# EasyEDA Pro project ProPrj_（课设）太阳能板最大功率点追踪主控板 Solar MPPT Tracking controlling board_2024-09-24.epro, board PCB1
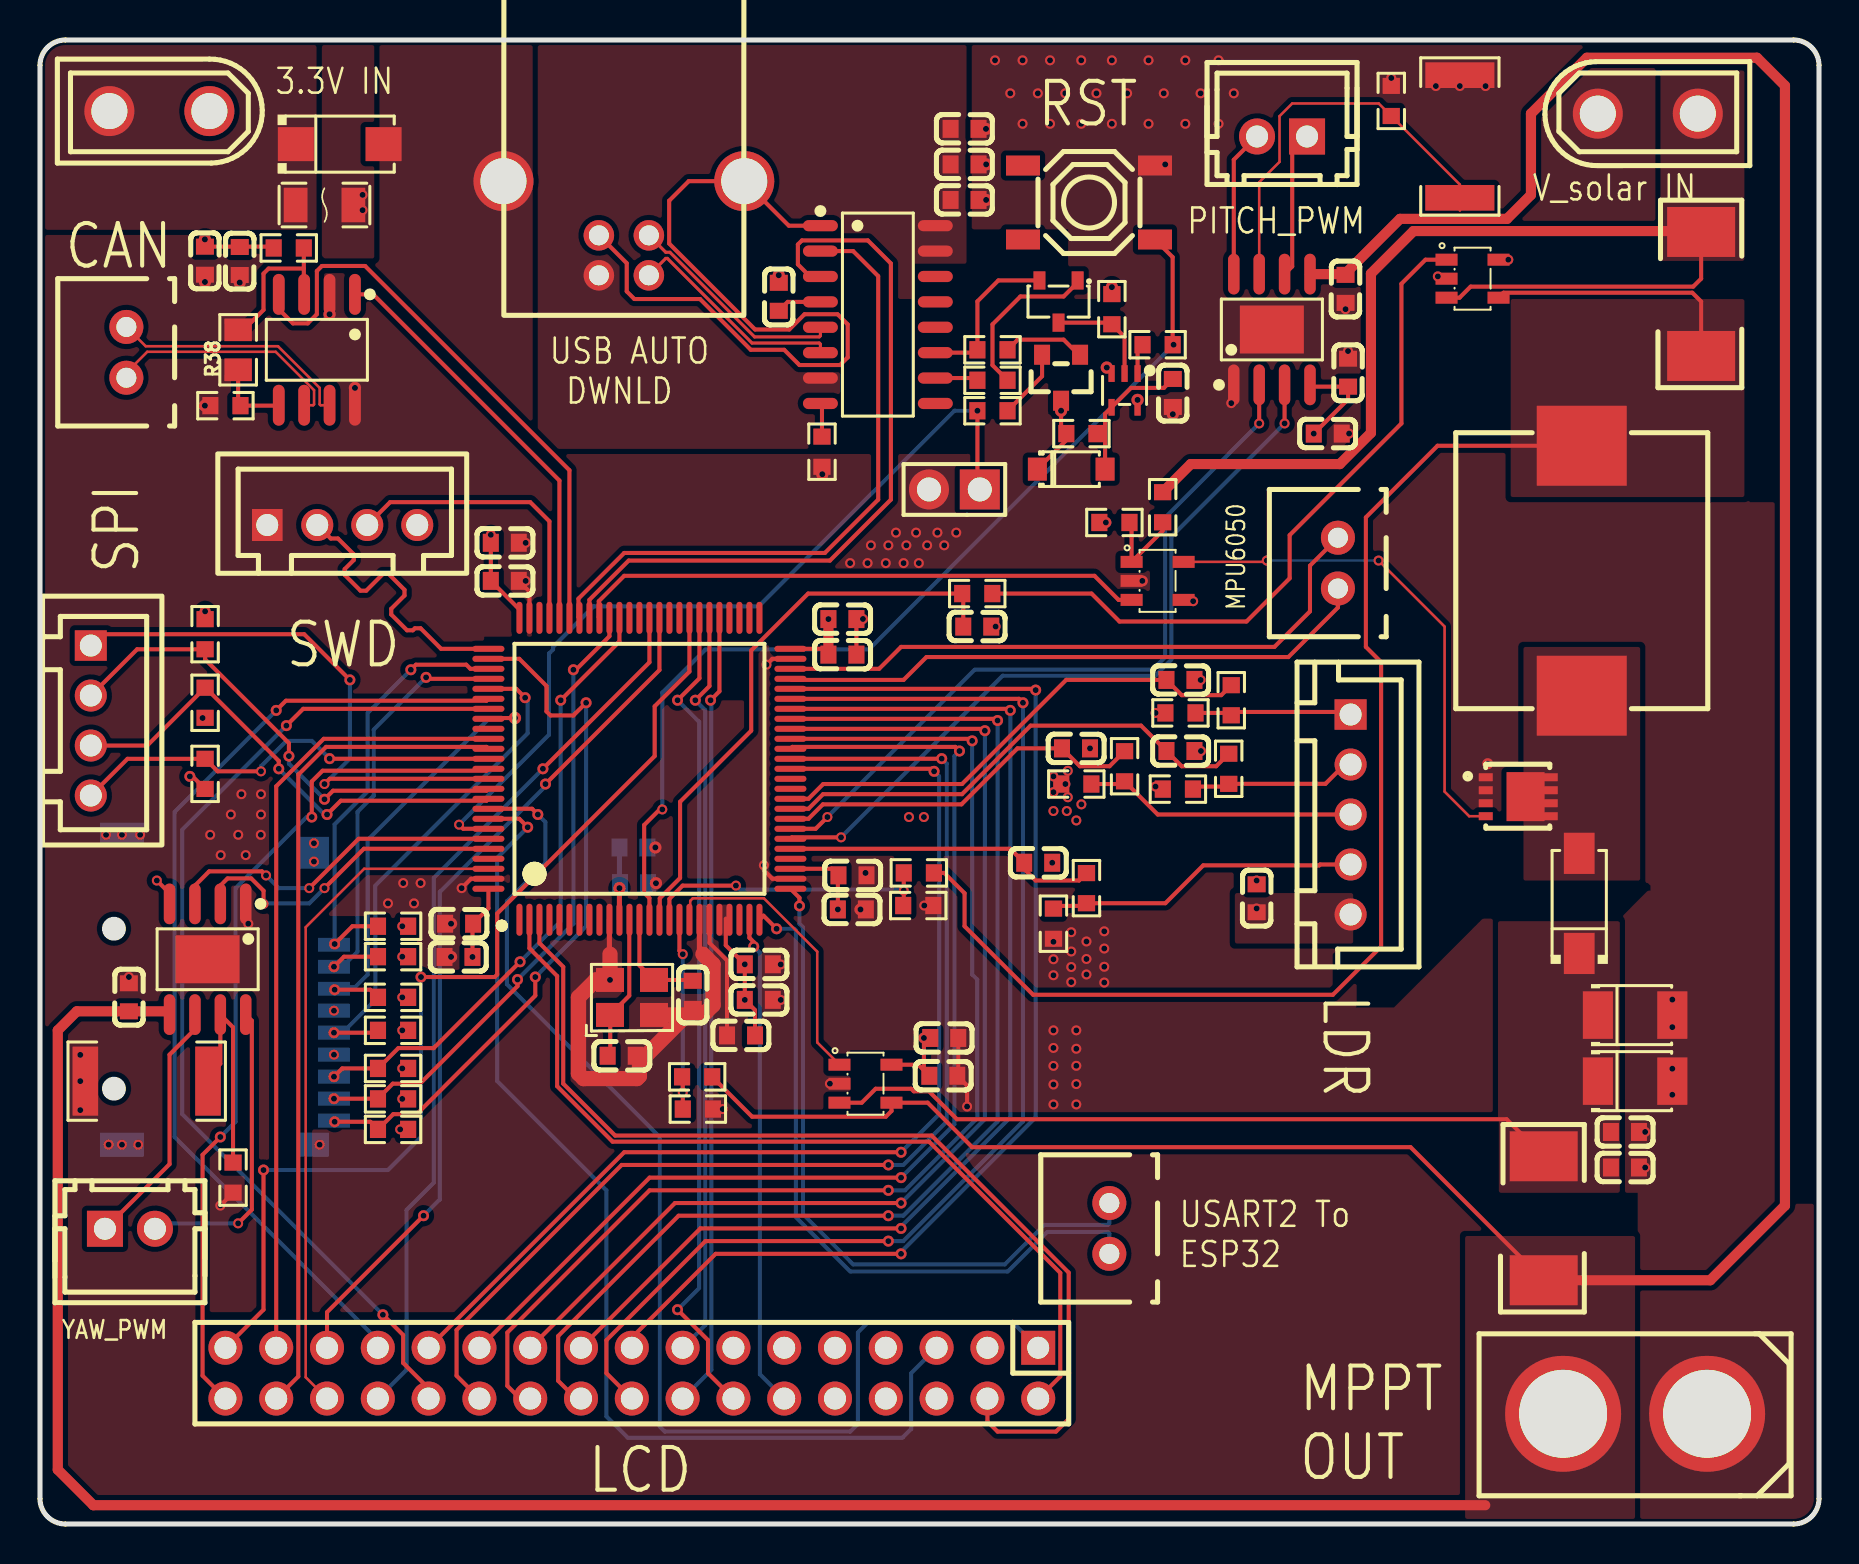
[diagram p4: board, top side]
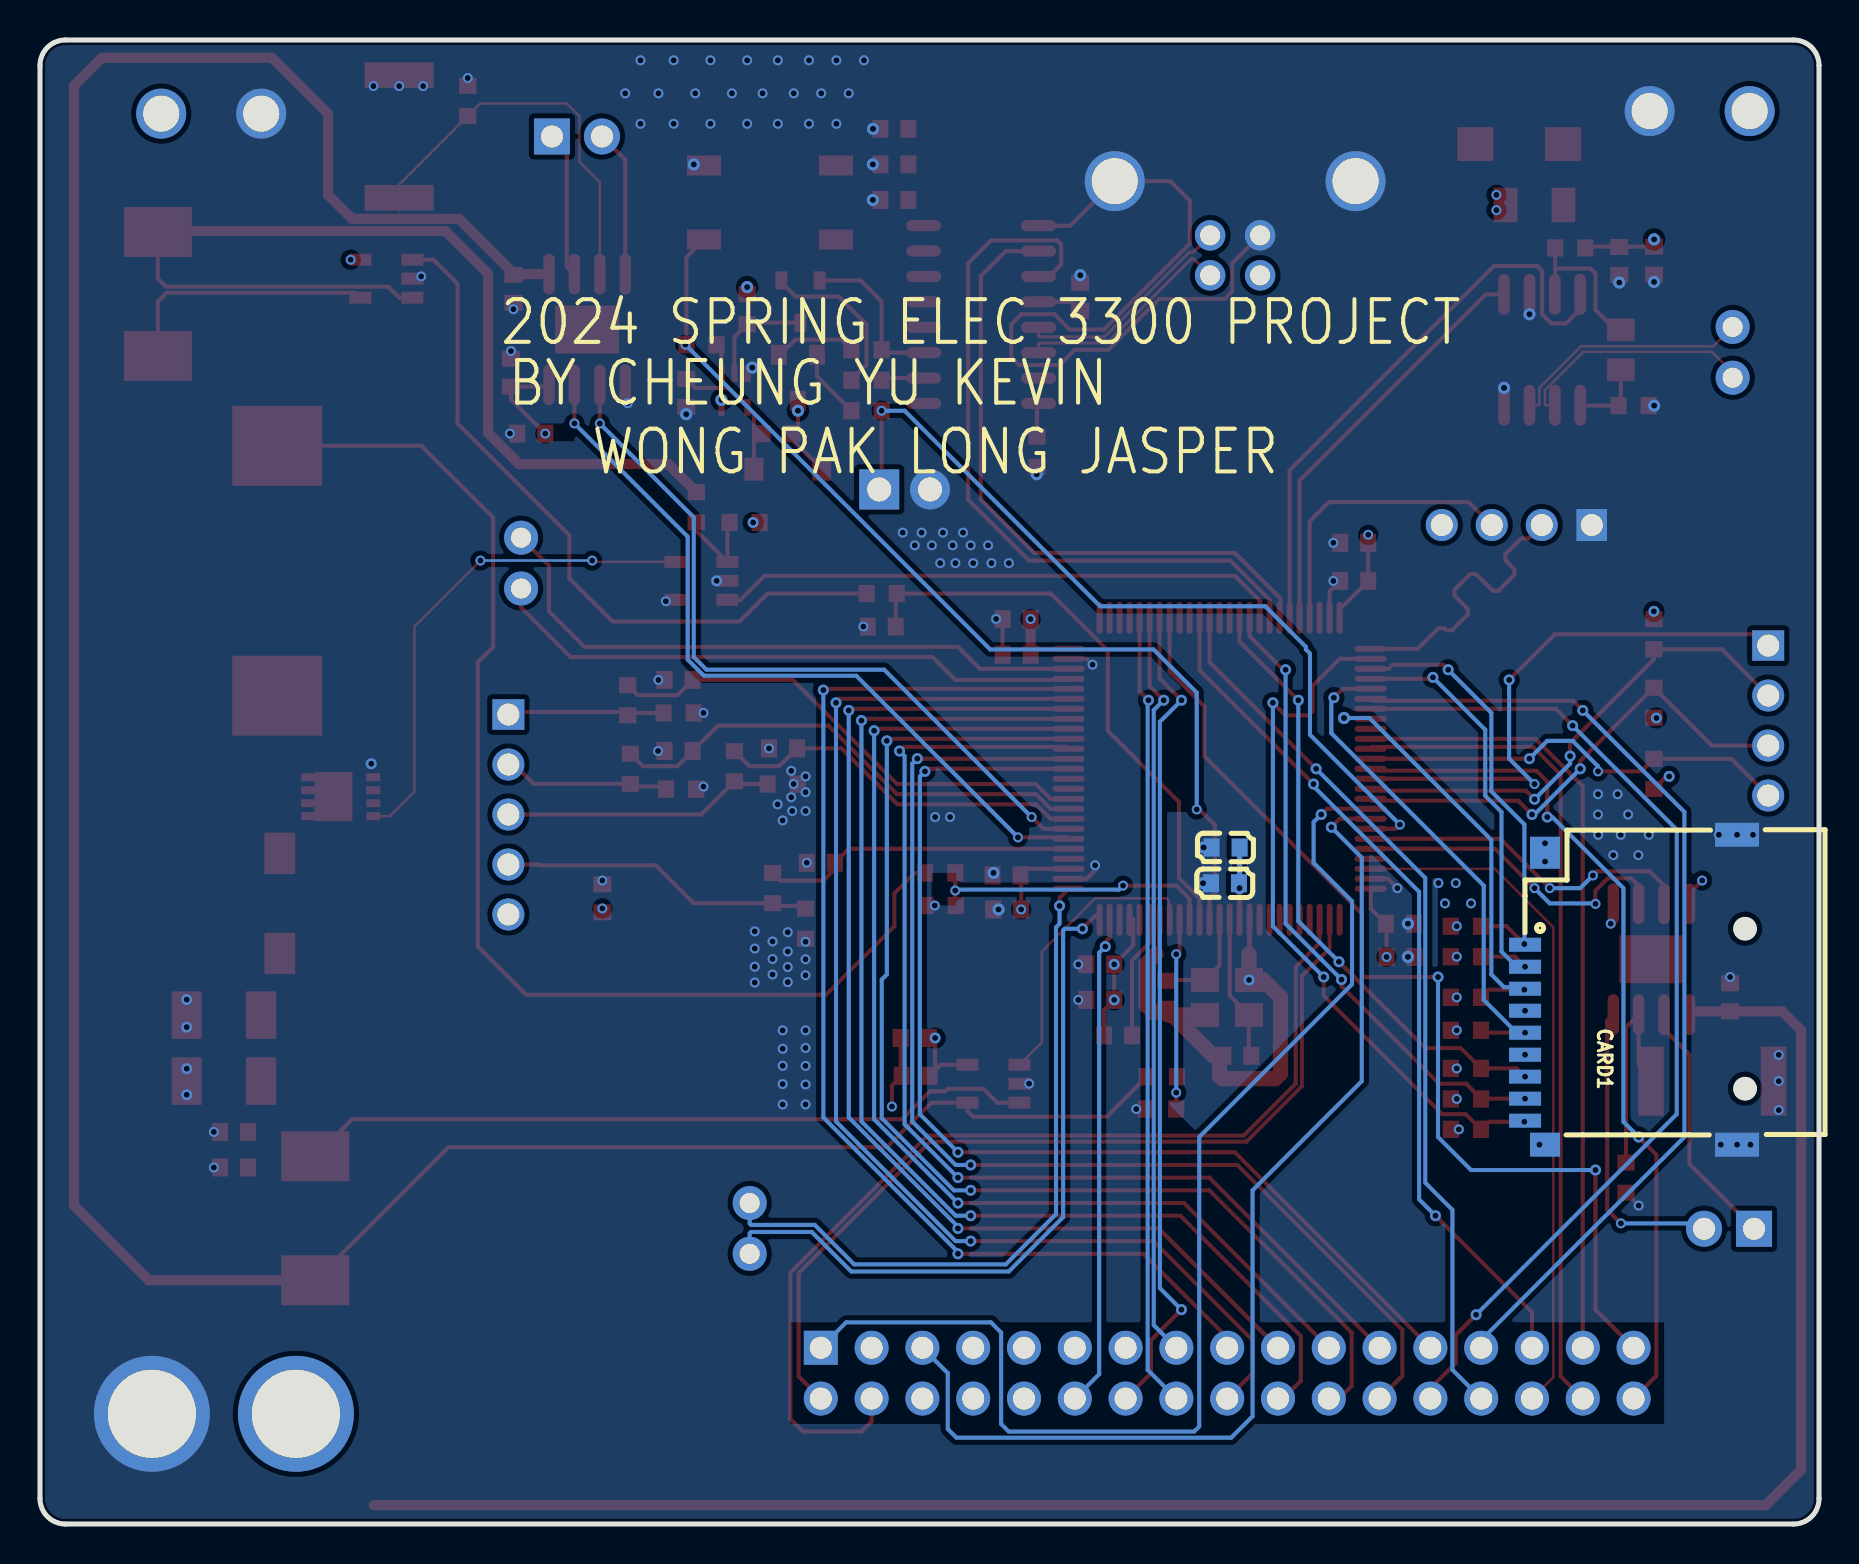
[diagram p5: board, bottom side, seen from below]

Outline 88.95 x 74.22 mm; copper layers: Top Layer, Inner1, Inner2, Bottom Layer. Coordinates in mm from the lower left corner of the outline.
Outline path: 0,72.95 0,1.27 arc(0.37,0.37) 1.27,0 87.68,0 arc(88.58,0.37) 88.95,1.27 88.95,72.95 arc(88.58,73.85) 87.68,74.22 1.27,74.22 arc(0.37,73.85) 0,72.95
Stack: Top Layer 0.035mm 外层铜厚1oz / Dielectric1 0.0994mm 3313 RC57% 4.2mil / Inner1 0.0152mm 内层铜厚 / Dielectric2 1.265mm 1.3mm H/HOZ 含铜 / Inner2 0.0152mm 内层铜厚 / Dielectric3 0.0994mm 3313 RC57% 4.2mil / Bottom Layer 0.035mm 外层铜厚1oz

## Design rules (mm)
net CAN_TX: DP3
net CAN_RX: DP3
net USART2_RX: DP5
net USART2_TX: DP5
net VET6-OSC_OUT: DP1
net VET6-OSC_IN: DP1
net CH343-D+: DP2
net CH343-D-: DP2
net $2N39854: DP4
net $2N39851: DP4
template: 自定义配置
spacing copperThickness1oz (default): track to track 0.102, other pairs 0.152 to 0.3
spacing copperThickness2oz: track to track 0.203, other pairs 0.152 to 0.3
track width copperThickness1oz (default): min 0.127, default 0.254, max 2.54
track width copperThickness2oz: min 0.203, default 0.254, max 2.54
differential pair differentialPair (default): width min 0.127, default 0.254, max 2.54; gap min 0.152, default 0.152
via viaSize (default): diameter min 0.5, default 0.61, max 10; hole min 0.3, default 0.305, max 6.3

## Placement (name value [footprint] x y rotation side)
C1  100nF  [C0603]  23.24 49.07 180 top
C2  100nF  [C0603]  23.24 47.17 180 top
C3  100nF  [C0603]  29.67 33.83 180 bottom
C4  100nF  [C0603]  29.7 32.04 180 bottom
C5  100nF  [C0603]  35.94 26.21 180 top
C6  100nF  [C0603]  35.94 27.99 180 top
C7  100nF  [C0603]  20.95 30.02 0 top
C8  100nF  [C0603]  20.92 28.36 0 top
C9  100nF  [C0603]  40.59 30.74 180 top
C10  100nF  [C0603]  40.62 32.44 180 top
C11  10nF  [C0603]  35.05 24.44 0 top
C12  100nF  [C0603]  40.12 43.48 180 top
C13  100nF  [C0603]  40.12 45.26 180 top
C14  100nF  [C0603]  46.23 69.77 0 top
C15  100nF  [C0603]  36.94 61.38 90 top
C16  10uF  [C0603]  46.23 68 0 top
C17  100nF  [C0603]  46.23 66.22 0 top
C18  100nF  [C0603]  56.64 56.57 90 top
C19  10pF  [C0603]  29.08 23.42 180 top
C20  10pF  [C0603]  32.64 26.47 90 top
C23  100nF  [C0603]  65.4 57.58 90 top
C24  10uF  [C0603]  64.39 54.53 0 top
C27  100nF  [C0603]  65.28 61.77 90 top
C28  100nF  [C0603]  4.44 26.34 270 top
C29  100nF  [C0603]  79.25 19.61 180 top
C30  100nF  [C0603]  79.25 17.83 180 top
C31  100uF  [CASE-B_3528]  79.76 25.45 0 top
C32  100uF  [CASE-B_3528]  79.76 22.15 0 top
C37  100nF  [C0603]  49.91 33.07 180 top
C38  100nF  [C0603]  51.8 38.79 180 top
C39  100nF  [C0603]  57.02 38.66 180 top
C40  100nF  [C0603]  57.02 42.22 180 top
C41  100nF  [C0603]  45.17 22.42 0 top
C42  10uF  [C0603]  45.21 24.31 0 top
C43  100nF  [C0603]  9.99 63.17 90 top
C44  100nF  [C0603]  8.25 63.18 90 top
C45  100nF  [C0603]  60.83 31.29 270 top
C46  100nF  [C0603]  46.86 44.88 0 top
CARD1  TF PUSH  [TF-SMD_TF-PUSH]  9.4 26.72 90 bottom
CN1  XT30UPB-M  [CONN-TH_XT30UPB-M]  80.39 70.54 0 top
CN2  XT30UPB-M  [CONN-TH_XT30UPB-M]  5.97 70.66 180 top
CN3  ZX-XH2.54-2PZZ  [CONN-TH_2P-P2.50_HX25003-2A]  4.5 14.77 0 top
CN4  ZX-XH2.54-2PZZ  [CONN-TH_2P-P2.50_HX25003-2A]  62.1 69.39 180 top
CN5  B2B-XH-A(LF)(SN)  [CONN-TH_B2B-XH-A-LF-SN]  4.32 58.6 90 top
CN6  B2B-XH-A(LF)(SN)  [CONN-TH_B2B-XH-A-LF-SN]  53.47 14.78 90 top
CN7  B2B-XH-A(LF)(SN)  [CONN-TH_B2B-XH-A-LF-SN]  64.9 48.06 90 top
D1  SS54  [SMA_L4.4-W2.8-LS5.4-R-RD]  76.96 31.04 90 top
D2  SMAJ5.0A  [SMA_L4.4-W2.6-LS5.0-RD]  14.99 69.01 0 top
F1  JK-nSMD050-30  [F1206]  14.22 65.96 0 top
H1  PH-00047  [HDR-TH_34P-P2.54-V-M-R2-C17-S2.54]  29.59 7.54 180 top
H2  PZ254V-11-02P  [HDR-TH_2P-P2.54-V-M]  45.72 51.74 180 top
L1  10uH  [IND-SMD_L13.8-W12.6_SMMS1360]  77.09 47.68 270 top
Q2  AO3401  [SOT-23-3_L2.9-W1.4-P1.90-LS2.6-BR]  50.93 61.14 90 top
Q3  AO3400  [SOT-23_L2.9-W1.3-P1.90-LS2.4-BR]  51.05 57.33 90 top
Q5  CSD17579Q3A  [SON-8_L3.0-W3.1-P0.65-BP-EP]  73.91 36.37 270 top
R1  4.7K  [R0603]  39.1 53.63 90 top
R2  10K  [R0603]  53.59 60.76 90 top
R3  2.7K  [R0603]  47.62 57.2 0 top
R4  1K  [R0603]  47.62 58.73 0 top
R5  1K  [R0603]  47.62 55.68 180 top
R6  2.7K  [R0603]  55.88 58.98 180 top
R7  100K  [R0603]  52.07 54.53 0 top
R8  50mΩ  [RES-SMD_L6.4-W3.2-1]  83.06 61.52 270 top
R10  100mΩ  [R2512]  70.99 69.39 90 top
R11  100mΩ  [R2512]  5.33 22.15 180 top
R12  0  [R0603]  9.65 17.32 270 top
R13  0  [R0603]  67.56 71.17 90 top
R14  10K  [R0603]  17.65 19.74 180 top
R15  10K  [R0603]  17.65 21.26 180 top
R16  10K  [R0603]  17.65 22.78 180 top
R17  10K  [R0603]  17.65 24.69 180 top
R18  10K  [R0603]  17.65 26.34 180 top
R19  10K  [R0603]  17.65 28.37 180 top
R20  10K  [R0603]  17.65 29.9 180 top
R21  1.5K  [R0603]  50.67 30.02 90 top
R25  1K  [R0603]  52.32 31.8 90 top
R26  1.5K  [R0603]  51.82 37.01 0 top
R27  1K  [R0603]  54.23 37.9 90 top
R28  1.5K  [R0603]  56.9 36.75 0 top
R29  1K  [R0603]  59.44 37.77 90 top
R30  1.5K  [R0603]  57.02 40.56 0 top
R31  1K  [R0603]  59.56 41.2 90 top
R32  10K  [R0603]  43.94 32.56 0 top
R33  2k  [R0603]  43.91 30.93 180 top
R34  15K  [R0603]  32.86 22.36 0 top
R35  2k  [R0603]  32.89 20.75 180 top
R36  50mΩ  [RES-SMD_L6.4-W3.2-1]  75.18 15.29 270 top
R37  10K  [R0603]  9.27 55.93 0 top
R38  10K  [R0805]  9.91 58.73 90 top
R39  0  [R0603]  12.44 63.82 180 top
R40  10K  [R0603]  8.25 37.52 270 top
R41  10K  [R0603]  8.25 41.07 270 top
R42  10K  [R0603]  8.25 44.5 90 top
R43  0  [R0603]  53.72 50.09 180 top
R44  0  [R0603]  56.13 50.85 90 top
R45  1K  [R0603]  46.86 46.53 180 top
SW1  TS-1187A-B-A-B  [SW-SMD_4P-L5.1-W5.1-P3.70-LS6.5-TL-2]  52.45 66.09 180 top
U1  STM32F103VET6  [LQFP-100_L14.0-W14.0-P0.50-LS16.0-BL]  29.97 37.77 0 top
U2  CH343G  [SOP-16_L10.0-W3.9-P1.27-LS6.0-BL]  41.89 60.49 270 top
U3  74HC1G66GW,125  [SOT-353_L2.1-W1.3-P0.65-LS2.3-BR]  54.23 56.69 90 top
U4  1N4148W  [SOD-123_L2.8-W1.8-LS3.7-RD]  51.56 52.76 0 top
U5  INA180A2IDBVT  [SOT-23-5_L3.0-W1.7-P0.95-LS2.8-BR]  71.63 62.28 180 top
U6  UCC27517DBVR  [SOT-23-5_L3.0-W1.7-P0.95-LS2.8-BR]  55.88 47.17 180 top
U10  DRV8870DDAR  [HSOP-8_L5.0-W4.0-P1.27-LS6.2-BL-EP]  61.59 59.74 0 top
U11  DRV8870DDAR  [HSOP-8_L5.0-W4.0-P1.27-LS6.2-BL-EP]  8.38 28.25 180 top
U14  INA180A2IDBVT  [SOT-23-5_L3.0-W1.7-P0.95-LS2.8-BR]  41.27 22.02 180 top
U15  SWD_Conn  [CONN-TH_4P-P2.50_4PIN]  15.11 49.96 0 top
U16  LDR_Conn  [CONN-TH_5P-P2.50_ZX-XH2.54-5PZZ]  65.53 35.48 270 top
U17  SN65HVD230DR  [SOIC-8_L4.9-W3.9-P1.27-LS6.0-BL]  13.84 58.73 180 top
U18  ZX-XH2.54-4PZZ  [CONN-TH_4P-P2.50_4PIN]  2.54 40.18 270 top
U19  XT60  [CONN-TH_XT60]  79.76 5.51 180 top
USB1  670688000  [USB-B-TH_67068-8000]  29.19 64.8 180 top
X1  8MHz  [OSC-SMD_4P-L3.2-W2.5-BL]  29.6 26.34 0 top

## Footprints (pads in the part's own frame, mm; a bottom-side part is the same pattern mirrored in y, then rotated)
C0603
  rect 0.8x0.9 smd: 1(-0.7,0) 2(0.7,0)
CASE-B_3528
  rect 1.506x2.376 smd: 1(-1.861,0) 2(1.861,0)
CONN-TH_2P-P2.50_HX25003-2A
  rect 1.8x1.8 hole 1.1: 1(-1.25,0)
  round 1.8 hole 1.1: 2(1.25,0)
CONN-TH_4P-P2.50_4PIN
  rect 1.524x1.6 hole 1.1: 1(-3.75,0)
  round 1.6 hole 1.1: 2(-1.25,0) 3(1.25,0) 4(3.75,0)
CONN-TH_5P-P2.50_ZX-XH2.54-5PZZ
  rect 1.524x1.6 hole 1.1: 1(-5,0)
  round 1.6 hole 1.1: 2(-2.5,0) 3(0,0) 4(2.5,0) 5(5,0)
CONN-TH_B2B-XH-A-LF-SN
  round 1.7 hole 1: 1(1.27,0) 2(-1.27,0)
CONN-TH_XT30UPB-M
  round 2.5 hole 1.8: 1(-2.5,0) 2(2.5,0)
CONN-TH_XT60
  round 5.8 hole 4.4: 1(-3.6,0) 2(3.6,0)
F1206
  rect 1.19x1.728 smd: 1(-1.445,0) 2(1.445,0)
HDR-TH_2P-P2.54-V-M
  rect 2x2 hole 1.2: 1(-1.27,0)
  round 2 hole 1.2: 2(1.27,0)
HDR-TH_34P-P2.54-V-M-R2-C17-S2.54
  rect 1.7x1.7 hole 1.1: 1(-20.32,-1.27)
  round 1.7 hole 1.1: 2(-20.32,1.27) 3(-17.78,-1.27) 4(-17.78,1.27) 5(-15.24,-1.27) 6(-15.24,1.27) 7(-12.7,-1.27) 8(-12.7,1.27) 9(-10.16,-1.27) 10(-10.16,1.27) 11(-7.62,-1.27) 12(-7.62,1.27) 13(-5.08,-1.27) 14(-5.08,1.27) 15(-2.54,-1.27) 16(-2.54,1.27) 17(0,-1.27) 18(0,1.27) 19(2.54,-1.27) 20(2.54,1.27) 21(5.08,-1.27) 22(5.08,1.27) 23(7.62,-1.27) 24(7.62,1.27) 25(10.16,-1.27) 26(10.16,1.27) 27(12.7,-1.27) 28(12.7,1.27) 29(15.24,-1.27) 30(15.24,1.27) 31(17.78,-1.27) 32(17.78,1.27) 33(20.32,-1.27) 34(20.32,1.27)
HSOP-8_L5.0-W4.0-P1.27-LS6.2-BL-EP
  oval 0.574x2.038 smd: 1(-1.905,-2.769) 2(-0.635,-2.769) 3(0.635,-2.769) 4(1.905,-2.769) 5(1.905,2.769) 6(0.635,2.769) 7(-0.635,2.769) 8(-1.905,2.769)
  rect 3.2x2.4 smd: 9(0,0)
IND-SMD_L13.8-W12.6_SMMS1360
  rect 4x4.5 smd: 1(-6.25,0) 2(6.25,0)
LQFP-100_L14.0-W14.0-P0.50-LS16.0-BL
  oval 0.3x1.6 smd: 1(-6,-7.55) 2(-5.5,-7.55) 3(-5,-7.55) 4(-4.5,-7.55) 5(-4,-7.55) 6(-3.5,-7.55) 7(-3,-7.55) 8(-2.5,-7.55) 9(-2,-7.55) 10(-1.5,-7.55) 11(-1,-7.55) 12(-0.5,-7.55) 13(0,-7.55) 14(0.5,-7.55) 15(1,-7.55) 16(1.5,-7.55) 17(2,-7.55) 18(2.5,-7.55) 19(3,-7.55) 20(3.5,-7.55) 21(4,-7.55) 22(4.5,-7.55) 23(5,-7.55) 24(5.5,-7.55) 25(6,-7.55) 51(6,7.55) 52(5.5,7.55) 53(5,7.55) 54(4.5,7.55) 55(4,7.55) 56(3.5,7.55) 57(3,7.55) 58(2.5,7.55) 59(2,7.55) 60(1.5,7.55) 61(1,7.55) 62(0.5,7.55) 63(0,7.55) 64(-0.5,7.55) 65(-1,7.55) 66(-1.5,7.55) 67(-2,7.55) 68(-2.5,7.55) 69(-3,7.55) 70(-3.5,7.55) 71(-4,7.55) 72(-4.5,7.55) 73(-5,7.55) 74(-5.5,7.55) 75(-6,7.55)
  oval 1.6x0.3 smd: 26(7.55,-6) 27(7.55,-5.5) 28(7.55,-5) 29(7.55,-4.5) 30(7.55,-4) 31(7.55,-3.5) 32(7.55,-3) 33(7.55,-2.5) 34(7.55,-2) 35(7.55,-1.5) 36(7.55,-1) 37(7.55,-0.5) 38(7.55,0) 39(7.55,0.5) 40(7.55,1) 41(7.55,1.5) 42(7.55,2) 43(7.55,2.5) 44(7.55,3) 45(7.55,3.5) 46(7.55,4) 47(7.55,4.5) 48(7.55,5) 49(7.55,5.5) 50(7.55,6) 76(-7.55,6) 77(-7.55,5.5) 78(-7.55,5) 79(-7.55,4.5) 80(-7.55,4) 81(-7.55,3.5) 82(-7.55,3) 83(-7.55,2.5) 84(-7.55,2) 85(-7.55,1.5) 86(-7.55,1) 87(-7.55,0.5) 88(-7.55,0) 89(-7.55,-0.5) 90(-7.55,-1) 91(-7.55,-1.5) 92(-7.55,-2) 93(-7.55,-2.5) 94(-7.55,-3) 95(-7.55,-3.5) 96(-7.55,-4) 97(-7.55,-4.5) 98(-7.55,-5) 99(-7.55,-5.5) 100(-7.55,-6)
OSC-SMD_4P-L3.2-W2.5-BL
  rect 1.4x1.2 smd: 1(-1.1,-0.875) 2(1.1,-0.875) 3(1.1,0.875) 4(-1.1,0.875)
R0603
  rect 0.806x0.864 smd: 1(-0.753,0) 2(0.753,0)
R0805
  rect 1.133x1.377 smd: 1(-1,0) 2(1,0)
R2512
  rect 1.282x3.456 smd: 1(-3.067,0) 2(3.067,0)
RES-SMD_L6.4-W3.2-1
  rect 2.5x3.4 smd: 1(-3.1,0) 2(3.1,0)
SMA_L4.4-W2.6-LS5.0-RD
  rect 1.8x1.7 smd: 1(-2.192,0) 2(2.192,0)
SMA_L4.4-W2.8-LS5.4-R-RD
  rect 2.062x1.539 smd: 1(2.503,0) 2(-2.503,0)
SOD-123_L2.8-W1.8-LS3.7-RD
  rect 0.95x1.15 smd: 1(-1.692,0) 2(1.692,0)
SOIC-8_L4.9-W3.9-P1.27-LS6.0-BL
  oval 0.588x2.045 smd: 1(-1.905,-2.772) 2(-0.635,-2.772) 3(0.635,-2.772) 4(1.905,-2.772) 5(1.905,2.772) 6(0.635,2.772) 7(-0.635,2.772) 8(-1.905,2.772)
SON-8_L3.0-W3.1-P0.65-BP-EP
  rect 0.4x0.7 smd: 1(-0.975,-1.625) 2(-0.325,-1.625) 3(0.325,-1.625) 4(0.975,-1.625) 5(0.975,1.624) 6(0.325,1.624) 7(-0.325,1.625) 8(-0.975,1.624)
  rect 2.45x1.9 smd: 9(-0.004,0.364)
SOP-16_L10.0-W3.9-P1.27-LS6.0-BL
  oval 0.56x1.745 smd: 1(-4.445,-2.873) 2(-3.175,-2.873) 3(-1.905,-2.873) 4(-0.635,-2.873) 5(0.635,-2.873) 6(1.905,-2.873) 7(3.175,-2.873) 8(4.445,-2.873) 9(4.445,2.873) 10(3.175,2.873) 11(1.905,2.873) 12(0.635,2.873) 13(-0.635,2.873) 14(-1.905,2.873) 15(-3.175,2.873) 16(-4.445,2.873)
SOT-23-3_L2.9-W1.4-P1.90-LS2.6-BR
  rect 0.91x0.6 smd: 1(1.055,-0.955) 2(1.055,0.955) 3(-1.055,0)
SOT-23-5_L3.0-W1.7-P0.95-LS2.8-BR
  rect 1.1x0.6 smd: 1(1.3,-0.95) 2(1.3,0) 3(1.3,0.95) 4(-1.3,0.95) 5(-1.3,-0.95)
SOT-23_L2.9-W1.3-P1.90-LS2.4-BR
  rect 1x0.8 smd: 1(1.15,-0.95) 2(1.15,0.95) 3(-1.15,0)
SOT-353_L2.1-W1.3-P0.65-LS2.3-BR
  rect 0.839x0.315 smd: 1(0.845,-0.65) 2(0.845,0) 3(0.845,0.65) 4(-0.845,0.65) 5(-0.845,-0.65)
SW-SMD_4P-L5.1-W5.1-P3.70-LS6.5-TL-2
  rect 1.7x1 smd: 1(-3.3,1.85) 2(3.3,1.85) 3(-3.3,-1.85) 4(3.3,-1.85)
TF-SMD_TF-PUSH
  rect 0.7x1.6 smd: 1(2.25,5.3) 2(1.15,5.3) 3(0.05,5.3) 4(-1.05,5.3) 5(-2.15,5.3) 6(-3.25,5.3) 7(-4.35,5.3) 8(-5.45,5.3) CD(-6.55,5.3)
  rect 1.2x1.5 smd: 10(-7.75,4.3)
  rect 1.2x2.2 smd: 11(-7.75,-5.3) 12(7.75,-5.3)
  rect 1.6x1.5 smd: 13(6.85,4.3)
USB-B-TH_67068-8000
  round 1.524 hole 1: 1(1.25,2.355) 2(-1.25,2.355) 3(-1.25,0.355) 4(1.25,0.355)
  round 3 hole 2.3: 5(6.02,-2.355) 6(-6.02,-2.355)

## Nets
As in the schematic, except:
SD_CARD_DETECT: CARD1.CD R14.2 U1.77

Pads without a net: H1 3 6 7; SW1 2 4; U1 1 4 5 6 8 9 29 36 37 51 52 53 54 59 60 63 64 73 84 97; U2 9 12 13 14

## Via types
v1: diameter 0.61, hole 0.305, Top Layer to Bottom Layer, 25 vias
v2: diameter 0.5, hole 0.3, Top Layer to Bottom Layer, 172 vias
v3: diameter 0.55, hole 0.3, Top Layer to Bottom Layer, 73 vias

## Routing (per net, layer and track width the routed paths; a pad name or vN(x,y) marks a point on that pad's centre or on a via; arc(x,y) is an arc through that point)
GND: length 83.4
  Top Layer w0.203: USB1.4 29.34,63.06 29.34,61.65 29.72,61.27 33,61.27 35.54,58.73 37.21,58.73 37.97,57.96 40,57.96 40.39,58.34 40.39,60 39.88,60.5 38.23,60.5 37.46,59.74 35.76,59.74 31.46,64.04 31.46,66.18 32.44,67.16 USB1.6 37.44,64.93 U2.1 ; C12.1 C13.1 ; v2(36.2,32.94) 36.2,32.7 36.62,32.27 U1.27 ; C42.2 45.91,22.46 45.87,22.42 46.36,21.93 v2(46.36,20.88) ; v2(21.08,31.8) 21.55,32.27 U1.99 ; C11.1 34.35,28.18 33.47,29.06 U1.20 ; U1.74 24.47,46.64 23.94,47.17 ; v2(9.02,15.93) 9.65,16.56 R12.2 ; v2(36.32,42.98) 36.61,43.27 U1.49
  Top Layer w0.254: U1.10 28.47,28.53 28.5,28.5 ; U1.19 32.97,28.67 33.15,28.5
  Top Layer w0.762: 32.33,25.46 30.29,23.42 29.78,23.42 29.97,23.23 29.97,22.4 29.84,22.28 27.18,22.28 26.92,22.53 26.92,26.34 27.79,27.21 v3(28.5,27.21) 28.5,28.5 ; 32.33,25.46 32.52,25.46 32.64,25.58 33.28,25.58 33.65,25.95 33.65,27.99 33.15,28.5 ; 32.33,25.46 X1.2
  vias: v1(8.25,62.12) v1(8.24,55.93) v1(9.99,62.09) v1(14.48,60.5) v1(15.75,56.82) v1(20.55,30.02) v1(20.55,28.36) v1(30.77,33.84) v1(30.8,32.05) v1(36.94,62.46) v1(39.12,52.5) v1(41.02,30.73) v1(41.27,32.56) v1(47.3,69.77) v1(47.31,68) v1(47.31,66.22) v1(53.34,57.84) v1(56.26,68) v1(56.64,55.5) v2(2.01,23.46) v2(2.01,22.15) v2(2.01,20.7) v2(3.3,34.47) v2(3.43,18.97) v2(4.1,34.47) v2(4.1,18.97) v2(4.44,27.36) v2(4.91,18.97) v2(5.01,34.47) v2(8.51,34.47) v2(9.03,33.45) v2(9.54,35.48) v2(9.91,34.47) v2(10.07,36.5) v2(10.29,33.45) v2(10.41,30.02) v2(11.05,36.5) v2(11.05,35.48) v2(11.04,34.47) v2(13.7,34.05) v2(13.7,33.13) v2(13.98,18.97) v2(14.7,23.47) v2(17.4,31.04) v2(18.16,32.06) v2(18.7,31.04) v2(19.03,32.06) v2(24.28,49.07) v2(24.28,47.17) v2(34.14,20.75) v2(37.04,27.99) v2(37.04,26.21) v2(39.5,22.02) v2(40.51,48.06) v2(41.15,45.26) v2(41.38,48.06) v2(41.55,48.95) v2(42.29,48.06) v2(42.42,48.95) v2(42.8,49.58) v2(43.18,48.06) v2(43.32,48.95) v2(43.45,35.36) v2(43.8,49.58) v2(43.94,48.06) v2(44.2,35.36) v2(44.21,30.93) v2(44.36,48.95) v2(44.87,49.58) v2(45.21,48.95) v2(45.81,49.58) v2(47.75,73.2) v2(47.78,44.88) v2(48.51,71.55) v2(49.13,73.2) v2(49.13,70.03) v2(49.89,71.55) v2(50.5,73.2) v2(50.5,70.03) v2(50.61,33.07) v2(50.67,37.39) v2(50.67,36.6) v2(50.67,35.66) v2(50.67,29.12) v2(50.67,28.25) v2(50.67,27.44) v2(50.67,24.69) v2(50.67,23.81) v2(50.67,22.91) v2(50.67,21.98) v2(50.67,20.98) v2(51.26,71.55) v2(51.27,37.01) v2(51.39,37.67) v2(51.39,36.35) v2(51.34,35.66) v2(51.56,29.6) v2(51.56,28.63) v2(51.56,27.86) v2(51.56,27.1) v2(51.82,35.19) v2(51.82,24.69) v2(51.82,23.77) v2(51.82,22.92) v2(51.82,22) v2(51.82,20.98) v2(52.06,73.2) v2(52.06,70.03) v2(52.07,35.99) v2(52.32,29.13) v2(52.32,28.26) v2(52.32,27.48) v2(52.5,38.79) v2(52.82,71.55) v2(53.21,29.64) v2(53.21,28.78) v2(53.21,27.87) v2(53.21,27.08) v2(53.59,73.2) v2(53.59,70.03) v2(54.36,71.55) v2(55.43,73.2) v2(55.43,70.03) v2(55.78,40.56) v2(55.78,36.88) v2(56.19,71.55) v2(57.27,73.2) v2(57.27,70.03) v2(57.66,46.15) v2(58.03,71.55) v2(58.03,42.21) v2(58.05,38.66) v2(58.93,73.2) v2(58.93,70.03) v2(59.56,56.06) v2(59.69,71.55) v2(60.83,32.18) v2(65.28,60.76) v2(65.4,58.66) v2(65.45,54.54) v2(67.56,72.32) v2(69.79,71.91) v2(69.89,62.4) v2(70.99,71.91) v2(72.28,71.91) v2(80.26,19.61) v2(80.26,17.83) v3(55.12,47.17) v3(72.39,38.02) v3(81.62,26.23) v3(81.62,24.85) v3(81.62,22.77) v3(81.62,21.47)
BOOT0: length 42.2
  Top Layer w0.203: v2(46.87,55.68) 46.87,52.24 46.94,52.17 ; U1.94 21.16,34.77 v2(20.95,34.98)
  Bottom Layer w0.203: 20.83,34.98 v2(20.95,34.98) 25.45,39.47 25.45,43.54 25.65,43.74 25.65,43.87 27.69,45.9 35.94,45.9 45.72,55.68 v2(46.87,55.68)
CAN_RX: length 29.6
  Top Layer w0.203: U17.4 11.94,60.76 12.65,60.05 13.39,60.05 13.84,60.5 13.84,62.66 14.1,62.92 16.26,62.92 26.47,52.7 U1.70
CAN_TX: length 20.9
  Top Layer w0.203: U1.71 25.97,52.18 16.66,61.5 U17.1
CH343-D+: length 11.1
  Top Layer w0.155: USB1.3 31.29,63.6 31.49,63.6 35.73,59.37 38.97,59.37 39.02,59.43 U2.5
CH343-D-: length 11.1
  Top Layer w0.155: USB1.2 31.29,63.3 31.37,63.3 35.6,59.06 38.97,59.06 39.02,59.01 U2.6
CPT_INT: length 50.9
  Top Layer w0.203: U1.3 24.97,29.05 26.16,27.86 26.16,22.02 28.76,19.43 44.58,19.43 51.43,12.57 51.43,5.26 50.8,4.62 47.88,4.62 47.37,5.13 H1.4
CPT_RST: length 44.7
  Top Layer w0.203: H1.2 51.01,7.38 51.01,12.56 44.45,19.12 28.63,19.12 25.86,21.9 25.86,27.41 24.47,28.79 U1.2
CPT_SCL: length 61.8
  Top Layer w0.203: v3(24.89,35.48) 24.61,35.77 U1.92
  Bottom Layer w0.203: v3(24.89,35.48) 25.27,35.11 25.27,33.07 23.35,31.15 23.35,27 30.99,19.36 30.99,4.88 31.24,4.62 40.51,4.62 40.89,5 40.89,9.58 41.4,10.08 48.64,10.08 H1.1
CPT_SDA: length 54.9
  Top Layer w0.203: U1.93 23.96,35.27 v3(24.38,34.85)
  Bottom Layer w0.203: H1.5 43.56,7.54 43.56,4.75 43.13,4.32 29.39,4.32 28.32,5.39 28.32,16.69 22.86,22.15 22.86,33.33 v3(24.38,34.85)
DTR: length 2.2
  Top Layer w0.203: U2.10 46.76,57.31 R3.1
FSMC_A16: length 51.9
  Top Layer w0.203: H1.33 11.18,10.72 v3(11.18,17.7) ; U1.58 32.47,42.63 30.73,40.89 30.73,38.41 22.86,30.53 22.86,27.48 22.73,27.36 v3(19.05,27.36)
  Bottom Layer w0.203: v3(11.18,17.7) 17.4,17.7 19.05,19.36 v3(19.05,27.36)
FSMC_D0: length 43.4
  Top Layer w0.203: U1.61 30.97,42.71 v3(25.27,37.01) ; v3(19.18,15.42) 14.35,10.59 H1.29
  Bottom Layer w0.203: v3(25.27,37.01) 25.27,36.9 19.99,31.62 19.99,16.24 v3(19.18,15.42)
FSMC_D1: length 44.7
  Top Layer w0.203: 30.48,45.33 U1.62 30.47,43.1 v3(25.15,37.77)
  Bottom Layer w0.203: H1.28 18.33,7.71 18.33,15.71 19.69,17.07 19.69,32.31 v3(25.15,37.77)
FSMC_D2: length 49
  Top Layer w0.203: U1.81 22.33,41.17 12.29,41.17 v3(11.81,40.69)
  Bottom Layer w0.203: H1.27 16.89,9.2 6.73,19.36 6.73,35.61 v3(11.81,40.69)
FSMC_D3: length 51.4
  Top Layer w0.203: v3(17.14,10.47) 18.16,9.45 18.16,8.06 19.43,6.78 H1.26 ; v3(12.32,39.93) 13.16,40.77 U1.82
  Bottom Layer w0.203: v3(12.32,39.93) 7.11,34.72 7.11,20.5 v3(17.14,10.47)
FSMC_D4: length 54.9
  Top Layer w0.203: v3(43.05,18.59) 29.21,18.59 H1.25 ; U1.38 44.58,37.77 v3(44.7,37.64)
  Bottom Layer w0.203: v3(44.7,37.64) 44.96,37.39 44.96,20.5 v3(43.05,18.59)
FSMC_D5: length 58.6
  Top Layer w0.203: v3(42.42,17.96) 29.08,17.96 20.83,9.7 20.83,7.42 H1.24 ; v3(45.08,38.28) 45.08,38.27 U1.39
  Bottom Layer w0.203: v3(45.08,38.28) 45.34,38.02 45.34,20.13 43.17,17.96 v3(42.42,17.96)
FSMC_D6: length 55.7
  Top Layer w0.203: U1.40 37.62,38.87 45.77,38.87 v3(45.97,38.66) ; H1.23 30.48,17.32 v3(43.05,17.32)
  Bottom Layer w0.203: v3(45.97,38.66) 45.72,38.41 45.72,19.99 v3(43.05,17.32)
FSMC_D7: length 60.1
  Top Layer w0.203: v3(46.61,39.17) 46.51,39.27 U1.41 ; v3(42.42,16.69) 30.48,16.69 23.37,9.58 23.37,6.91 24,6.27 H1.22
  Bottom Layer w0.203: v3(42.42,16.69) 43.26,16.69 46.86,20.29 46.86,27.23 46.61,27.48 v3(46.61,39.17)
FSMC_D8: length 56.7
  Top Layer w0.203: H1.21 31.75,16.05 v3(43.05,16.05) ; U1.42 47.15,39.77 v3(47.24,39.68)
  Bottom Layer w0.203: v3(43.05,16.05) 47.24,20.24 v3(47.24,39.68)
FSMC_D9: length 60.6
  Top Layer w0.203: v3(47.88,40.18) 47.79,40.27 U1.43 ; H1.20 26.8,6.27 25.91,7.16 25.91,9.4 31.93,15.42 v3(42.42,15.42)
  Bottom Layer w0.203: v3(47.88,40.18) 47.88,20.13 43.17,15.42 v3(42.42,15.42)
FSMC_D10: length 57.7
  Top Layer w0.203: U1.44 48.43,40.77 v3(48.51,40.69) ; H1.19 33.02,14.78 v3(43.05,14.78)
  Bottom Layer w0.203: v3(43.05,14.78) 43.05,14.87 48.51,20.34 v3(48.51,40.69)
FSMC_D11: length 61.5
  Top Layer w0.203: v3(49.15,41.07) 48.95,41.27 U1.45 ; v3(42.42,14.15) 33.27,14.15 28.32,9.2 28.32,7.54 H1.18
  Bottom Layer w0.203: v3(49.15,41.07) 49.15,20.13 43.17,14.15 v3(42.42,14.15)
FSMC_D12: length 59
  Top Layer w0.203: v3(43.05,13.51) 33.78,13.51 29.59,9.32 H1.17 ; v3(49.78,41.71) 49.72,41.77 U1.46
  Bottom Layer w0.203: v3(43.05,13.51) 43.05,13.6 49.78,20.34 v3(49.78,41.71)
FSMC_D13: length 39.8
  Top Layer w0.203: v3(33.53,41.2) 33.97,41.64 U1.55
  Bottom Layer w0.203: v3(33.53,41.2) 33.57,41.16 33.57,7.71 H1.16
FSMC_D14: length 37.5
  Top Layer w0.203: U1.56 33.47,41.91 v3(32.77,41.2)
  Bottom Layer w0.203: v3(32.77,41.2) 33.26,40.7 33.26,9.95 H1.15
FSMC_D15: length 41.6
  Top Layer w0.203: H1.14 33.4,7.54 33.4,9.2 v3(31.88,10.72) ; U1.57 32.97,42.29 v3(31.88,41.2)
  Bottom Layer w0.203: v3(31.88,10.72) 32.96,11.8 32.96,40.12 v3(31.88,41.2)
FSMC_NE1: length 42.8
  Top Layer w0.203: U1.88 22.33,37.67 14.13,37.67 13.59,37.14 v3(13.59,35.36) ; H1.34 8.13,7.42 8.13,18.47 v3(9.02,19.36)
  Bottom Layer w0.203: v3(13.59,35.36) 13.33,35.36 9.78,31.8 9.78,20.12 v3(9.02,19.36)
FSMC_NOE: length 39.7
  Top Layer w0.203: U1.85 14.19,39.27 11.81,36.9 H1.31
FSMC_NWE: length 41.8
  Top Layer w0.203: U1.86 22.33,38.87 14.3,38.87 12.91,37.48 12.91,7.38 H1.32
I2C2_SCL: length 29.8
  Top Layer w0.203: U1.47 37.58,42.22 43.18,42.22 44.32,43.36 62.42,43.36 64.9,45.84 CN7.2
I2C2_SDA: length 31.4
  Top Layer w0.203: CN7.1 63.5,47.93 63.5,45.64 61.72,43.87 43.05,43.87 41.96,42.77 U1.48
INPUT_CURRENT_ADC: length 28.8
  Top Layer w0.203: C46.1 46.16,46.48 R45.2 38.41,46.53 35.56,43.69 35.56,39.68 32,36.12 32,32.31 30.99,31.29 30.99,30.24 U1.15
INPUT_VOLTAGE_ADC: length 14.8
  Top Layer w0.203: v2(34.8,31.93) 32.13,31.93 31.47,31.27 U1.16 ; R33.2 43.19,30.96 v2(43.19,31.68) R32.1
  Bottom Layer w0.203: v2(43.19,31.68) 43.14,31.73 35,31.73 v2(34.8,31.93)
LCD_PWM: length 24.7
  Top Layer w0.203: v3(35.69,28.88) 35.69,29.1 35.47,29.32 U1.24
  Bottom Layer w0.203: H1.12 35.99,7.49 35.99,28.58 v3(35.69,28.88)
LCD_RST: length 34.4
  Top Layer w0.127: H1.30 13.28,7.34 13.28,29.85 16.21,32.77 U1.98
LDR1_ADC: length 15.8
  Top Layer w0.203: R25.2 51.95,32.18 49.78,32.18 49.21,32.76 C37.2 48.51,33.77 U1.30
LDR1_TAP: length 15.7
  Top Layer w0.203: U16.4 64.01,32.98 63.96,32.94 58.16,32.94 56.27,31.05 R25.1 52.19,30.91 50.66,30.91
LDR2_ADC: length 18.8
  Top Layer w0.203: R27.2 53.48,37.9 51.99,37.9 C38.2 48.87,38.79 46.07,35.99 39.15,35.99 38.42,35.27 U1.33
LDR2_TAP: length 13.7
  Top Layer w0.203: U16.3 55.89,35.48 R27.1 54.09,37.01 R26.2
LDR3_ADC: length 24.7
  Top Layer w0.203: U1.34 38.42,35.77 39.15,36.5 46.1,36.5 49.53,39.93 55.05,39.93 C39.2 57.08,37.9 58.81,37.9 R29.2
LDR3_TAP: length 8.2
  Top Layer w0.203: 57.78,36.88 59.3,36.88 R29.1 64.27,37.02 65.24,37.98 U16.2
LDR4_ADC: length 25
  Top Layer w0.203: U1.35 38.42,36.27 39.16,37.01 46.1,37.01 51.31,42.22 C40.2 57.08,41.45 59.06,41.45 R31.2
LDR4_TAP: length 7.9
  Top Layer w0.203: U16.1 65.4,40.61 59.73,40.61 R31.1 59.44,40.56 R30.2
MOSFET_DRIVER_OUT: length 25.3
  Top Layer w0.127: v2(61.34,48.18) 61.27,48.12 U6.5 ; Q5.4 71.46,35.4 70.23,36.63 70.23,44.88 v2(66.93,48.18)
  Bottom Layer w0.127: v2(66.93,48.18) v2(61.34,48.18)
MPPT_PWM: length 28.5
  Top Layer w0.203: U1.67 27.94,45.35 27.94,46.15 29.21,47.42 52.72,47.42 53.93,46.22 U6.3
MPPT_VCC: length 247.6
  Top Layer w0.203: R34.2 35.6,20.37 42.29,20.37 42.58,20.66 U14.4 44.38,21.07 46.61,18.85 68.53,18.85 R36.2
  Top Layer w0.508: R36.2 83.51,12.19 87.25,15.93 87.25,71.93 85.85,73.33 77.34,73.33 74.55,70.54 74.55,66.47 73.35,65.27 68,65.27 65.24,62.51 ; U10.5 65.24,62.51 ; 65.24,62.51 C27.2 ; U11.5 6.31,25.64 C28.2 1.84,25.64 0.89,24.69 0.89,2.72 2.67,0.94 72.26,0.94
NRST: length 50.3
  Top Layer w0.203: R6.1 56.63,63.36 SW1.1 ; U1.14 30.47,31.3 30.21,31.56 30.21,34.96 30.99,35.74 v2(31.11,35.74)
  Bottom Layer w0.203: v2(56.68,58.98) 41.44,43.74 33.27,43.74 31.11,41.58 v2(31.11,35.74)
OUTPUT_CURRENT_ADC: length 14.6
  Top Layer w0.127: U1.18 32.51,30.26 32.51,31.17 32.64,31.29 36.2,31.29 38.86,28.63 38.86,24.09 39.97,22.97
OUTPUT_VOLTAGE_ADC: length 10.3
  Top Layer w0.203: R34.1 32.14,22.33 v2(32.14,21.58) R35.2 ; v2(32.14,28.5) 31.97,28.67 U1.17
  Bottom Layer w0.203: v2(32.14,21.58) v2(32.14,28.5)
PITCH_DRIVER_PWM_1: length 7.3
  Top Layer w0.203: CN4.1 62.61,68.65 62.61,62.89 U10.6
PITCH_DRIVER_PWM_2: length 7.4
  Top Layer w0.203: CN4.2 59.69,68.23 U10.8
PWM_PITCH_1: length 38.9
  Top Layer w0.203: U1.31 37.59,34.34 v2(40.05,34.34) ; v2(62.23,55.04) U10.3
  Bottom Layer w0.203: 40,34.34 v2(40.05,34.34) 48.13,42.42 55.76,42.42 55.79,42.47 55.8,42.47 56.57,43.23 56.57,49.38 v2(62.23,55.04)
PWM_PITCH_2: length 37.9
  Top Layer w0.203: v2(39.37,35.36) 38.78,34.77 U1.32 ; v2(60.96,55.04) U10.2
  Bottom Layer w0.203: v2(60.96,55.04) 56.26,50.34 56.26,43.36 55.63,42.73 46.74,42.73 v2(39.37,35.36)
PWM_YAW_1: length 17.3
  Top Layer w0.203: v2(13.46,31.8) 15.93,34.27 U1.95 ; v2(11.3,32.44) 11.1,32.64 8.46,32.64 7.75,31.93 7.75,31.01
  Bottom Layer w0.203: v2(13.46,31.8) 11.94,31.8 v2(11.3,32.44)
PWM_YAW_2: length 16.5
  Top Layer w0.203: U1.96 16.19,33.77 v2(14.22,31.8) ; v2(11.18,31.01) 11.18,31.67 10.56,32.29 9.38,32.29 9.02,31.93 U11.2
  Bottom Layer w0.203: 11.18,31.04 13.46,31.04 v2(14.22,31.8)
RTS: length 8.1
  Top Layer w0.203: R4.1 46.87,61.15 47.92,62.19 Q2.2 ; U2.11 46.86,58.58 46.87,58.6
SD_CARD_DETECT: length 35.7
  Top Layer w0.203: v3(24.77,27.36) 24.77,26.42 18.84,20.5 17.66,20.5 R14.2 16.52,20.12 v3(14.73,20.12) ; v3(27.3,41.07) 26.67,40.44 25.53,40.44 25.32,40.64 25.32,41.91 23.96,43.27 U1.77
  Bottom Layer w0.203: v3(24.77,27.36) 27.3,29.9 v3(27.3,41.07)
SDIO_CK: length 25.3
  Top Layer w0.203: v3(24.26,41.33) 23.81,41.77 U1.80 ; R17.2 16.78,24.57 v3(14.7,24.57)
  Bottom Layer w0.203: v3(24.26,41.33) 24.38,41.2 24.38,39.55 16.76,31.93 16.76,26.21 15.12,24.57 v3(14.7,24.57)
SDIO_CMD: length 22.3
  Top Layer w0.203: v1(23.75,40.31) 22.46,40.31 U1.83 ; R18.2 16.52,26.72 v3(14.73,26.72)
  Bottom Layer w0.203: CARD1.3 14.77,26.85 15.75,26.85 16.38,27.48 16.38,34.21 22.48,40.31 v1(23.75,40.31)
SDIO_D0: length 30.9
  Top Layer w0.203: v3(26.03,41.2) 28.97,44.14 U1.65 ; v3(14.7,22.37) 15.11,22.78 R16.2 17.92,23.8 19.68,23.8 v3(24,28.12)
  Bottom Layer w0.203: v3(26.03,41.2) 26.03,30.15 v3(24,28.12)
SDIO_D1: length 31.9
  Top Layer w0.203: v3(26.67,42.72) 26.8,42.72 28.47,44.4 U1.66 ; v3(14.7,21.27) 16.89,21.27 ; 16.89,21.27 R15.2 ; 16.89,21.27 17.64,22.02 19,22.02 23.88,26.9 v3(23.88,27.23)
  Bottom Layer w0.203: v3(26.67,42.72) 26.67,30.02 v3(23.88,27.23)
SDIO_D2: length 22.1
  Top Layer w0.203: v3(18.54,42.72) 18.8,42.98 21.31,42.98 21.52,42.77 U1.78 ; 14.6,29.13 v3(14.73,29.01) 15.62,29.9 R20.2
  Bottom Layer w0.203: v3(14.73,29.01) 14.73,34.99 16.38,36.64 16.38,40.56 v3(18.54,42.72)
SDIO_D3: length 22.2
  Top Layer w0.203: U1.79 19.38,42.27 v3(19.3,42.34) ; v3(14.7,27.87) 15.2,28.37 R19.2
  Bottom Layer w0.203: v3(14.7,27.87) 15.12,27.87 15.88,28.63 15.88,35.61 16.69,36.42 16.69,39.73 v3(19.3,42.34)
SOLAR_AFTER_SHUNT: length 74
  Top Layer w0.203: R8.2 83.06,61.14 82.62,61.58 73.18,61.58 U5.4 ; R32.2 45.21,32.56 46.23,31.55 46.23,29.9 49.66,26.47 64.64,26.47 67.06,28.88 67.06,43.1 66.29,43.87 66.29,50.34 69.88,53.93 L1.1
SOLAR_PWR: length 52.5
  Top Layer w0.203: U5.3 70.98,61.33 71.53,61.89 82.66,61.89 83.06,62.28 R8.1
  Top Layer w0.508: R44.2 57.54,53.01 64.99,53.01 66.55,54.57 66.55,62.54 68.68,64.66 83.01,64.66 R8.1
SPI1_CS: length 22.1
  Top Layer w0.203: U1.87 14.49,38.27 v3(14.48,38.28) ; U18.4 4.38,38.27 R40.1 8.88,37.64 v2(11.05,37.64)
  Bottom Layer w0.203: v3(14.48,38.28) 13.59,39.17 12.32,39.17 11.05,37.9 v2(11.05,37.64)
SPI1_MISO: length 25.1
  Top Layer w0.203: v3(12.45,38.41) 12.45,39.05 8.25,43.25 R42.1 4.85,43.75 U18.2 ; v3(14.22,36.25) 14.65,36.67 22.33,36.67 U1.90
  Bottom Layer w0.203: v3(12.45,38.41) 12.45,38.02 v3(14.22,36.25)
SPI1_MOSI: length 24.1
  Top Layer w0.203: v3(11.94,37.77) 11.94,38.17 8.39,41.71 ; U1.91 22.33,36.17 15.04,36.17 v3(14.35,35.48) ; R41.1 5.36,38.93 U18.3
  Bottom Layer w0.203: v3(11.94,37.77) 14.22,35.48 v3(14.35,35.48)
SPI1_SCK: length 28.2
  Top Layer w0.203: v3(15.49,42.22) 13.21,44.5 3.11,44.5 U18.1 ; v2(14.22,37.01) 14.49,37.27 U1.89
  Bottom Layer w0.203: v3(15.49,42.22) 15.49,38.28 v2(14.22,37.01)
STM32-3.3V: length 45.4
  Top Layer w0.203: 44.2,22.69 43.91,22.97 42.58,22.97 ; 44.2,22.69 v3(44.2,24.31) C42.1 ; 44.2,22.69 C41.1 ; C44.2 11.62,63.88 R39.2 ; R40.2 7.63,37.39 v3(7.49,37.39) ; C11.2 35.75,25.7 v3(35.24,26.21) v3(35.24,27.99) 34.29,28.94 34.29,30.28 ; v2(39.89,30.74) 39.89,32.41 C10.2 39.6,32.77 U1.28 ; U10.4 63.59,56.88 65.4,56.88 65.4,56.25 v2(63.69,54.53) ; U1.75 23.97,45.74 C2.2 C1.2 ; U11.4 6.48,31.55 v2(5.84,32.18) ; v3(8.13,40.31) 8.25,40.31 R41.2 ; Q3.3 v1(51.05,55.68) 51.05,54.8 R7.1 51.32,54.2 U4.1 ; U1.50 39.13,43.77 C12.2 ; v2(21.62,28.36) 21.62,29.99 C7.2 22.42,30.79 U1.100
  Top Layer w0.254: U1.11 v1(28.97,31.8)
  Top Layer w0.508: v2(39.42,45.26) C12.2
  Bottom Layer w0.254: v1(28.97,31.8) C3.2
  vias: v1(8.24,64.25) v1(53.59,61.86) v1(54.88,56.22) v2(14.7,25.67) v2(16.13,66.47) v2(16.13,65.71) v2(18.01,19.74) v2(18.11,29.9) v2(18.11,28.37) v2(18.11,26.34) v2(18.11,24.69) v2(18.11,22.78) v2(18.11,21.26) v2(22.54,49.47) v2(60.83,30.79) v2(73.42,63.23) v3(8.25,45.64) v3(53.3,50.09)
STM32-USART1_RX: length 32.6
  Top Layer w0.203: U1.69 26.92,45.37 26.92,46.28 29.21,48.57 39.24,48.57 41.91,51.23 41.91,62.41 40.66,63.66 U2.2
STM32-USART1_TX: length 37.4
  Top Layer w0.203: U2.3 38.5,62.39 37.89,62.99 37.89,63.99 38.1,64.2 41.39,64.2 42.55,63.04 42.55,51.23 39.5,48.18 29.43,48.18 27.47,46.22 U1.68
SWDCLK: length 14.8
  Top Layer w0.203: U15.2 14.54,49.29 14.9,49.29 15.69,48.5 15.69,48.21 15.23,47.76 15.23,47.47 16.02,46.68 16.31,46.68 17.15,47.51 17.43,47.51 18.22,46.72 18.22,46.44 17.56,45.77 17.56,45.49 18.35,44.7 18.64,44.7 18.74,44.8 19.03,44.8 20.05,43.77 U1.76
SWDIO: length 14.8
  Top Layer w0.203: U15.3 17.51,51.11 24.51,51.11 25.47,50.14 U1.72
USART2_RX: length 34.8
  Top Layer w0.203: v3(37.97,30.91) 37.97,31.32 U1.26
  Bottom Layer w0.203: v3(37.97,30.91) 37.97,30.02 38.15,29.84 38.15,15.5 40.66,12.98 48.24,12.98 50.22,14.96 53.39,14.96 53.47,15.03 CN6.1
USART2_TX: length 35.2
  Top Layer w0.203: U1.25 36.18,30.42 v3(36.83,29.77)
  Bottom Layer w0.203: v3(36.83,29.77) 37.72,29.77 37.79,29.7 37.79,15.35 40.51,12.63 48.39,12.63 50.36,14.61 53.39,14.61 53.47,14.53 CN6.2
VET6-OSC_IN: length 7
  Top Layer w0.203: 28.51,23.67 28.51,25.45 X1.1 29.46,26.42 29.46,30.21 U1.12
VET6-OSC_OUT: length 5.3
  Top Layer w0.203: U1.13 29.97,27.94 X1.3 32.6,27.21 C20.2
YAW_DRIVER_PWM_1: length 12.6
  Top Layer w0.203: CN3.1 6.48,18 6.48,23.47 7.75,24.74 7.75,25.48
YAW_DRIVER_PWM_2: length 15.1
  Top Layer w0.203: U11.8 10.59,25.17 10.59,15.72 v2(9.91,15.04)
  Bottom Layer w0.203: v2(9.91,15.04) 6.02,15.04 CN3.2
$1N6591: length 36.9
  Top Layer w0.203: R36.1 73.33,20.24 45.85,20.24 44.45,21.64 43.69,21.64 43.56,21.77 41.78,21.77 41.09,21.07 U14.3
$1N8545: length 4.6
  Top Layer w0.203: R43.1 54.58,49.98 U6.1 56.13,49.67 R44.1
$1N9784: length 36.1
  Top Layer w0.203: R45.1 52.58,46.53 53.97,45.14 60.33,45.14 62.48,47.3 62.48,49.45 68.07,55.04 68.07,62.03 69.28,63.23 U5.1
$2N3481: length 2.3
  Top Layer w0.203: U2.4 37.39,61.12 C15.1
$2N3665: length 1.7
  Top Layer w0.203: R1.2 39.1,55.96 U2.8
$2N4610: length 8.3
  Top Layer w0.203: R3.2 47.62,57.95 47.62,60 49.02,61.39 51.18,61.39 51.88,62.09 Q2.1
$2N4710: length 4.1
  Top Layer w0.203: R4.2 48.89,59.23 51.18,59.23 51.94,58.48 Q3.1
$2N4796: length 3.5
  Top Layer w0.203: R5.1 50.1,57.4 Q3.2
$2N4863: length 5.4
  Top Layer w0.203: Q2.3 53.52,60.08 R2.1 54.23,59.37 U3.2
$2N4911: length 1.5
  Top Layer w0.203: R6.2 54.88,58.73 U3.1
$2N5163: length 6.9
  Top Layer w0.203: U4.2 53.25,55.52 U3.4 54.55,56.82 56.2,56.82 C18.2
$2N39851: length 12.1
  Top Layer w0.127: U17.6 13.66,55.95 13.7,56 13.7,56.71 11.79,58.62 5.36,58.62 4.32,57.58 CN5.2
$2N39854: length 12.3
  Top Layer w0.127: CN5.1 5.28,58.9 11.9,58.9 13.98,56.82 13.98,56 14.03,55.95 U17.7
$2N40189: length 4
  Top Layer w0.203: U17.5 11.92,55.93 R37.2 9.91,56.05 9.91,57.97
$2N40263: length 8
  Top Layer w0.203: U17.3 13.21,62.15 13.19,62.17 13.19,62.79 ; 13.19,62.79 R39.1 ; 13.19,62.79 11.43,62.79 11.18,62.54 11.18,60.72 9.93,59.48 9.91,59.48
$3N926: length 11.4
  Top Layer w0.203: R12.1 9.65,24.84 U11.7 9.02,23.02 8.15,22.15
$3N1009: length 20.6
  Top Layer w0.127: U10.7 60.96,67.11 61.98,68.12 61.98,70.41 62.61,71.04 66.94,71.04 R13.1 70.99,66.99 70.99,65.69

## Copper pours and planes (outline as drawn; the poured copper is in the pictures)
GND on Top Layer: 71.75,38.41 72.77,38.41 72.77,35.74 71.75,35.74
GND on Top Layer: 0,74.35 88.9,74.35 88.9,0.05 0,0.05
GND on Bottom Layer: 0,74.35 88.9,74.35 88.9,0.05 0,0.05
GND on Inner1: 0.26,73.96 88.69,73.96 88.69,0.26 0.26,0.26
VBUS on Top Layer: 46.33,74.08 46.33,53.77 24.89,53.77 24.89,74.08
MPPT_VCC on Top Layer: 71.25,14.4 79.76,14.4 79.76,-2.27 71.25,-2.27
SOLAR_AFTER_SHUNT on Top Layer: 73.53,61.27 85.22,61.27 85.22,51.36 73.53,51.36
SOLAR_PWR on Top Layer: 81.03,72.7 85.22,72.7 85.22,63.17 81.03,63.17
STM32-3.3V on Top Layer: 66.59,31.56 66.59,29.03 59.75,29.03 59.75,31.56
STM32-3.3V on Top Layer: 14.1,73.97 14.1,63.42 14.22,63.3 16.71,63.3 16.71,73.97
STM32-3.3V on Inner2: 0.26,73.96 88.69,73.96 88.69,0.26 0.26,0.26
$1N2269 on Top Layer: 74.17,43.87 80.01,43.87 80.01,32.18 74.17,32.18
$1N6591 on Top Layer: 72.9,30.15 78.99,30.15 78.99,16.56 72.9,16.56
$2N54361 on Top Layer: 0,74.35 13.82,74.35 13.82,64.73 0,64.73

Small or netless copper shapes (teardrops, artwork), in the pictures only: 1 on Top Layer

## Text on the board
Bottom Silkscreen Layer: BY CHEUNG YU KEVIN / WONG PAK LONG JASPER | 2024 SPRING ELEC 3300 PROJECT
Top Silkscreen Layer: MPU6050 | YAW_PWM | 3.3V IN | USB AUTO / DWNLD | USART2 To / ESP32 | PITCH_PWM | V_solar IN | SWD | LCD | RST | MPPT / OUT | SPI | LDR | CAN
